# Altium schematic sheet DAC.SchDoc: uSDR schematic
size Letter; Author: Ye-sheng Kuo; CompanyName: Univ. of Michigan; Revision: 2.0; SheetNumber: 4; SheetTotal: 16
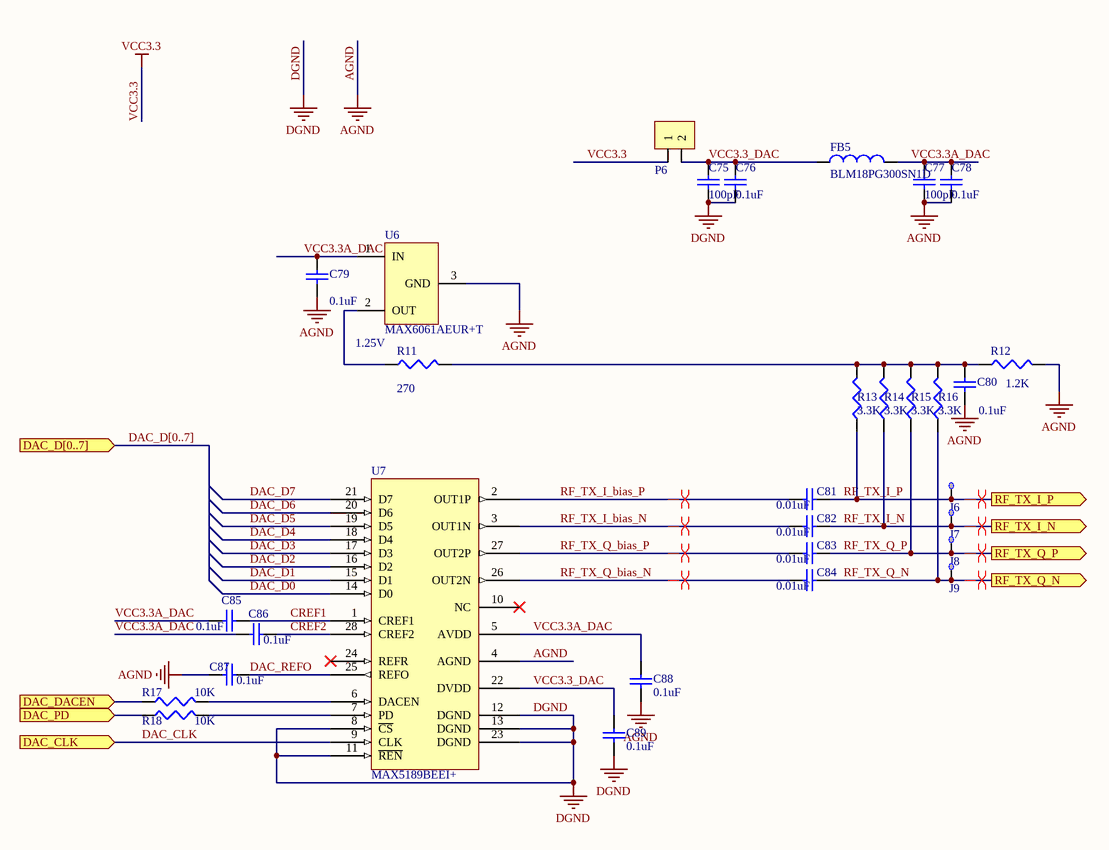
[diagram p0: DAC.SchDoc]

## Parts
C75  100pF  [0402]
C76  0.1uF  [0402]
C77  100pF  [0402]
C78  0.1uF  [0402]
C79  0.1uF  [0402]
C80  0.1uF  [0402]
C81  0.01uF  [0402]
C82  0.01uF  [0402]
C83  0.01uF  [0402]
C84  0.01uF  [0402]
C85  0.1uF  [0402]
C86  0.1uF  [0402]
C87  0.1uF  [0402]
C88  0.1uF  [0402]
C89  0.1uF  [0402]
FB5  BLM18PG300SN1D  [1608[0603]]
J6  5004  [TestPoint]  (value not drawn)
J7  5004  [TestPoint]  (value not drawn)
J8  5004  [TestPoint]  (value not drawn)
J9  5004  [TestPoint]  (value not drawn)
P6  1 x 2 header  [1x2 header]  (value not drawn)
R11  270  [0402]
R12  1.2K  [0402]
R13  3.3K  [0402]
R14  3.3K  [0402]
R15  3.3K  [0402]
R16  3.3K  [0402]
R17  10K  [0402]
R18  10K  [0402]
U6  MAX6061AEUR+T  value 1.25V  [SOT23-3N]
U7  MAX5189BEEI+  [SOP63P600X173-28N]

## Ports
DAC_CLK (in), DAC_D[0..7] (in), DAC_DACEN (in), DAC_PD (in), RF_TX_I_N (out), RF_TX_I_P (out), RF_TX_Q_N (out), RF_TX_Q_P (out)

## Nets
AGND: C77.1 C78.1 C79.1 C80.1 C87.1 C88.2 R12.2 U6.3(GND) U7.4(AGND)
DGND: C75.1 C76.1 C89.2 U7.8(~{CS}) U7.11(~{REN}) U7.12(DGND) U7.13(DGND) U7.23(DGND)
VCC3.3: P6.1
CREF1: C85.2 U7.1(CREF1)
CREF2: C86.2 U7.28(CREF2)
DAC_CLK: U7.9(CLK) ; port DAC_CLK
DAC_D0: U7.14(D0)
DAC_D1: U7.15(D1)
DAC_D2: U7.16(D2)
DAC_D3: U7.17(D3)
DAC_D4: U7.18(D4)
DAC_D5: U7.19(D5)
DAC_D6: U7.20(D6)
DAC_D7: U7.21(D7)
DAC_DACEN: R17.1 ; port DAC_DACEN
DAC_PD: R18.1 ; port DAC_PD
DAC_REFO: C87.2 U7.25(REFO)
RF_TX_I_bias_N: C82.1 U7.3(OUT1N)
RF_TX_I_bias_P: C81.1 U7.2(OUT1P)
RF_TX_I_N: C82.2 J7.1(TB) R14.1 ; port RF_TX_I_N
RF_TX_I_P: C81.2 J6.1(TB) R13.1 ; port RF_TX_I_P
RF_TX_Q_bias_N: C84.1 U7.26(OUT2N)
RF_TX_Q_bias_P: C83.1 U7.27(OUT2P)
RF_TX_Q_N: C84.2 J9.1(TB) R16.1 ; port RF_TX_Q_N
RF_TX_Q_P: C83.2 J8.1(TB) R15.1 ; port RF_TX_Q_P
VCC3.3_DAC: C75.2 C76.2 C89.1 FB5.1 P6.2 U7.22(DVDD)
VCC3.3A_DAC: C77.2 C78.2 C79.2 C85.1 C86.1 C88.1 FB5.2 U6.1(IN) U7.5(AVDD)
NetC80_2: C80.2 R11.2 R12.1 R13.2 R14.2 R15.2 R16.2
NetR11_1: R11.1 U6.2(OUT)
NetR17_2: R17.2 U7.6(DACEN)
NetR18_2: R18.2 U7.7(PD)

Not connected (* = marked no-connect by the designer): U7 10(NC)* 24(REFR)*

## Buses and harness runs
bus DAC_D[0..7] = port DAC_D[0..7]

## Layout directives
differential pair: RF_TX_I_bias_N, RF_TX_I_bias_P, RF_TX_I_N, RF_TX_I_P, RF_TX_Q_bias_N, RF_TX_Q_bias_P, RF_TX_Q_N, RF_TX_Q_P

## Notes on the sheet
- Title
- Date:
- Author:
- Revision:
- Sheet
- of
- University of Michigan
- File:

## Library data of the parts
C75-C89 = Cap Semi: Capacitor (Semiconductor SIM Model); Published: 8-Jun-2000; LatestRevisionDate: 29-May-2009; LatestRevisionNote: IPC-7351 Footprint Added.; PackageReference: C1206; Publisher: Altium Limited; PackageDescription: Chip Capacitor
  C75 C77: Value: 100pF
  C76 C78-C80 C85-C89: Value: 0.1uF
  C81-C84: Value: 0.01uF
FB5 = Ferrite Bead: FERRITE CHIP 30 OHM 1000MA 0603; Supplier 1: Digi-Key; Supplier Part Number 1: 490-1035-2-ND
J6-J9 = TestPoint: TEST POINT PC MINI .040"D YELLOW; Supplier 1: Digi-Key; Supplier Part Number 1: 5004K-ND; datasheet: http://mail.keyelco.com/ENG._DEPT/PDF%20CAT%20NO%20Drawings/5004.pdf
P6 = 1 x 2 header: 100 mils standard header
R11-R18 = Res3: Resistor; Published: 8-Jun-2000; LatestRevisionDate: 29-May-2009; LatestRevisionNote: IPC-7351 Footprint Added.; PackageReference: J1-0603; Publisher: Altium Limited; PackageDescription: Chip Resistor
  R11: Value: 270
  R12: Value: 1.2K
  R13-R16: Value: 3.3K
  R17 R18: Value: 10K
U6 = MAX6061: IC REF VOLT LDO SOT23-3; Supplier 1: Digi-Key; Supplier Part Number 1: MAX6061AEUR+TCT-ND
U7 = MAX5189: IC DAC 8BIT DUAL 40MHZ 28-QSOP; Supplier 1: Digi-Key; Supplier Part Number 1: MAX5189BEEI+-ND